# EAGLE design ethernet_jack_cnc_shield (EAGLE 9.5.0)
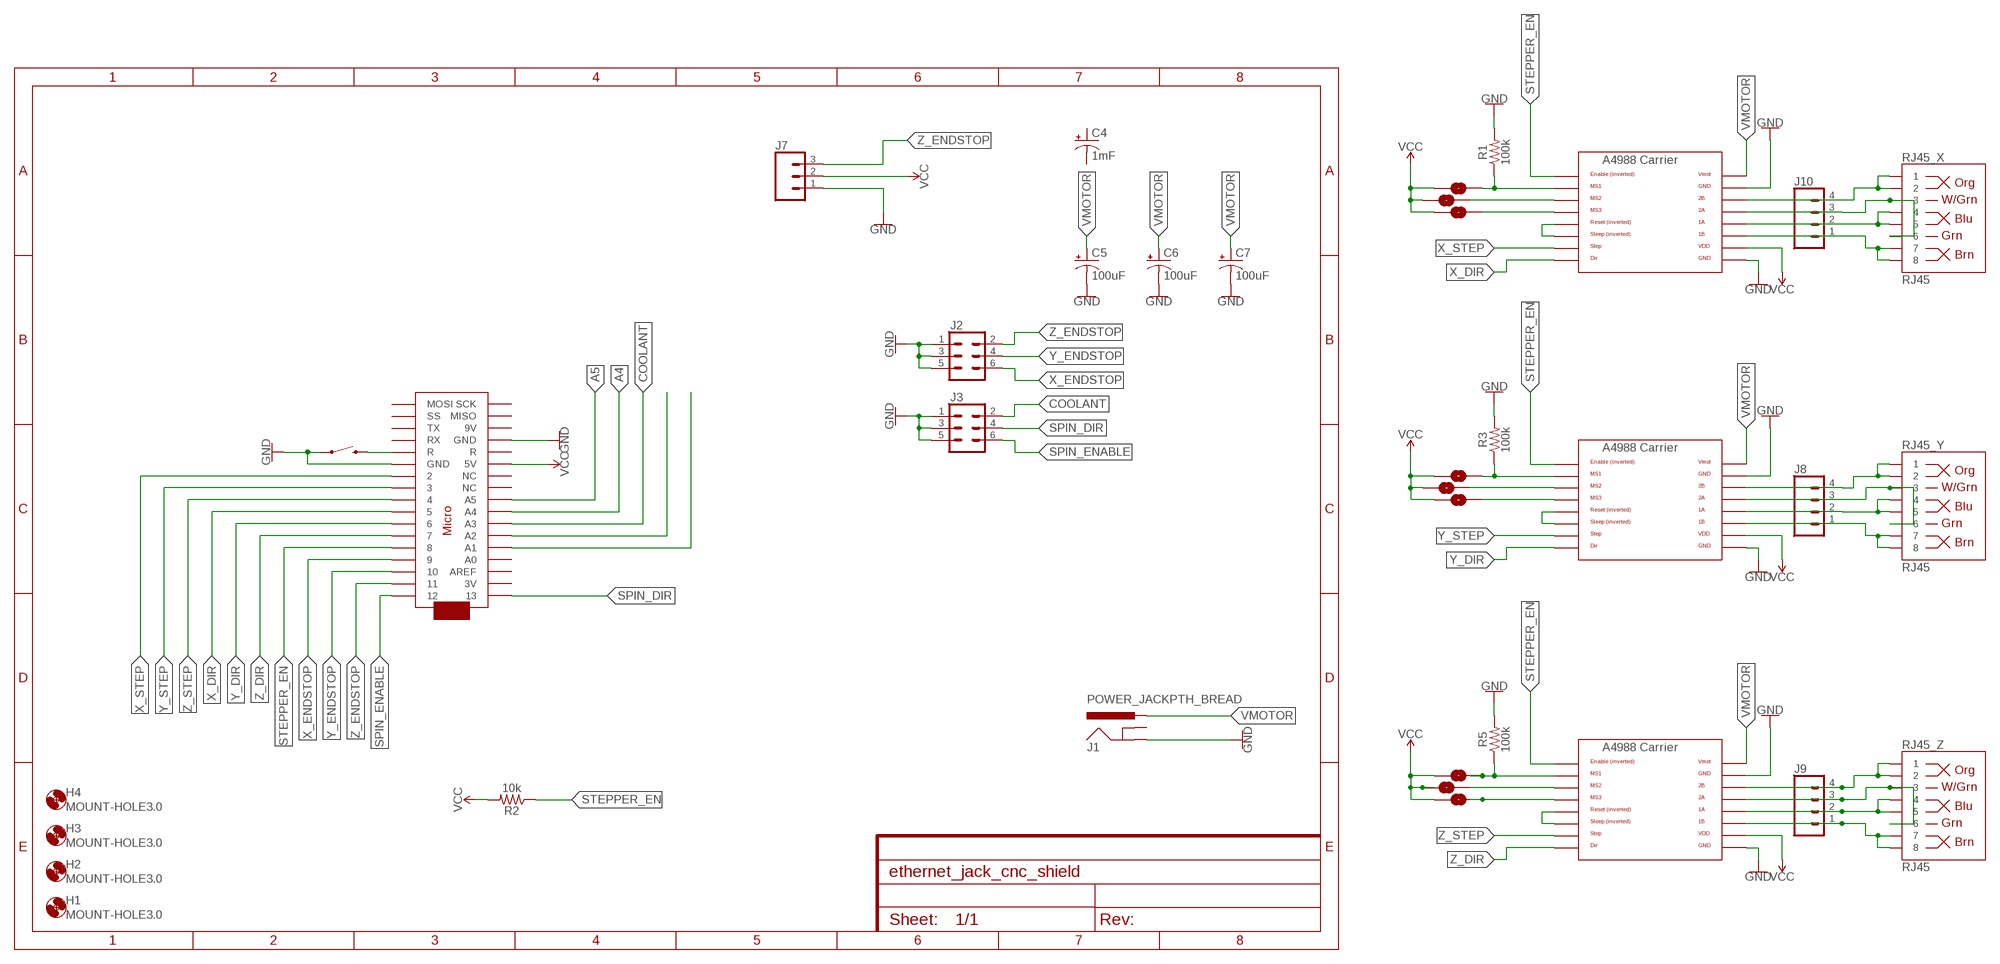
[diagram p0: schematic, sheet 1]

## Parts
C4  1mF  1000UF-RADIAL-5MM-25V-20%  [CPOL-RADIAL-5MM-10MM]
C5  100uF  100UF-POLAR-RADIAL-2.5MM-25V-20%  [CPOL-RADIAL-2.5MM-6.5MM]
C6  100uF  100UF-POLAR-RADIAL-2.5MM-25V-20%  [CPOL-RADIAL-2.5MM-6.5MM]
C7  100uF  100UF-POLAR-RADIAL-2.5MM-25V-20%  [CPOL-RADIAL-2.5MM-6.5MM]
H1  MOUNT-HOLE3.0  [3,0]
H2  MOUNT-HOLE3.0  [3,0]
H3  MOUNT-HOLE3.0  [3,0]
H4  MOUNT-HOLE3.0  [3,0]
J1  POWER_JACKPTH_BREAD  [POWER_JACK_PTH_BREAD]
J2  CONN_03X2NO_SILK  [2X3-NS]
J3  CONN_03X2NO_SILK  [2X3-NS]
J7  CONN_03  [1X03]
J8  CONN_04  [1X04]
J9  CONN_04  [1X04]
J10  CONN_04  [1X04]
JP1  JUMPER-SMT_2_NO_SILK_ROUND  [SMT-JUMPER_2_NO_SILK_ROUND]
JP2  JUMPER-SMT_2_NO_SILK_ROUND  [SMT-JUMPER_2_NO_SILK_ROUND]
JP3  JUMPER-SMT_2_NO_SILK_ROUND  [SMT-JUMPER_2_NO_SILK_ROUND]
JP4  JUMPER-SMT_2_NO_SILK_ROUND  [SMT-JUMPER_2_NO_SILK_ROUND]
JP5  JUMPER-SMT_2_NO_SILK_ROUND  [SMT-JUMPER_2_NO_SILK_ROUND]
JP6  JUMPER-SMT_2_NO_SILK_ROUND  [SMT-JUMPER_2_NO_SILK_ROUND]
JP7  JUMPER-SMT_2_NO_SILK_ROUND  [SMT-JUMPER_2_NO_SILK_ROUND]
JP8  JUMPER-SMT_2_NO_SILK_ROUND  [SMT-JUMPER_2_NO_SILK_ROUND]
JP9  JUMPER-SMT_2_NO_SILK_ROUND  [SMT-JUMPER_2_NO_SILK_ROUND]
R1  100k  RESISTOR1206  [1206]
R2  10k  RESISTOR1206  [1206]
R3  100k  RESISTOR1206  [1206]
R5  100k  RESISTOR1206  [1206]
RJ45_X  RJ45  RJ45-8  [RJ45-8]
RJ45_Y  RJ45  RJ45-8  [RJ45-8]
RJ45_Z  RJ45  RJ45-8  [RJ45-8]
S1  MOMENTARY-SWITCH-SPST-PTH-RIGHT-ANGLE-KIT  [TACTILE_SWITCH_PTH_RIGHT_ANGLE_KIT]
U$1  ARDUINOMICRO  [ARDUINOMICRO]
U$2  A4988BREAKOUT  [A4988BREAKOUT]
U$3  A4988BREAKOUT  [A4988BREAKOUT]
U$4  A4988BREAKOUT  [A4988BREAKOUT]

## Nets
A4: U$1.P$27(A4)
A5: U$1.P$26(A5)
COOLANT: J3.2 U$1.P$28(A3)
GND: C5.2(-) C6.2(-) C7.2(-) J1.GND J2.1 J2.3 J2.5 J3.1 J3.3 J3.5 J7.1 R1.2 R3.2 R5.2 S1.1 U$1.P$12(GND) U$1.P$21(GND) U$2.GND U$2.GND@0(GND) U$3.GND U$3.GND@0(GND) U$4.GND U$4.GND@0(GND)
N$1: J10.4 RJ45_X.1 RJ45_X.2 U$4.2B
N$4: J10.3 RJ45_X.3 RJ45_X.6 U$4.2A
N$6: J10.2 RJ45_X.4 RJ45_X.5 U$4.1A
N$8: J10.1 RJ45_X.7 RJ45_X.8 U$4.1B
N$10: S1.2 U$1.P$22(R)
N$12: JP6.2 U$4.MS3
N$15: U$4.RST U$4.SLP(SLEEP)
N$16: JP4.2 R1.1 U$4.MS1
N$17: JP5.2 U$4.MS2
N$18: U$1.P$29(A2)
N$19: U$1.P$30(A1)
N$20: J8.4 RJ45_Y.1 RJ45_Y.2 U$2.2B
N$21: J8.3 RJ45_Y.3 RJ45_Y.6 U$2.2A
N$22: J8.2 RJ45_Y.4 RJ45_Y.5 U$2.1A
N$23: J8.1 RJ45_Y.7 RJ45_Y.8 U$2.1B
N$24: JP7.2 U$2.MS3
N$25: JP1.2 R3.1 U$2.MS1
N$26: JP2.2 U$2.MS2
N$27: U$2.RST U$2.SLP(SLEEP)
N$28: J9.4 RJ45_Z.1 RJ45_Z.2 U$3.2B
N$29: J9.3 RJ45_Z.3 RJ45_Z.6 U$3.2A
N$30: J9.2 RJ45_Z.4 RJ45_Z.5 U$3.1A
N$31: J9.1 RJ45_Z.7 RJ45_Z.8 U$3.1B
N$32: JP9.2 U$3.MS3
N$33: JP3.2 R5.1 U$3.MS1
N$34: JP8.2 U$3.MS2
N$35: U$3.RST U$3.SLP(SLEEP)
SPIN_DIR: J3.4 U$1.P$34
SPIN_ENABLE: J3.6 U$1.P$1
STEPPER_EN: R2.1 U$1.P$5 U$2.EN U$3.EN U$4.EN
VCC: J7.2 JP1.1 JP2.1 JP3.1 JP4.1 JP5.1 JP6.1 JP7.1 JP8.1 JP9.1 R2.2 U$1.P$23(5V) U$2.VDD U$3.VDD U$4.VDD
VMOTOR: C5.1(+) C6.1(+) C7.1(+) J1.PWR U$2.VMOT U$3.VMOT U$4.VMOT
X_DIR: U$1.P$8 U$4.DIR
X_ENDSTOP: J2.6 U$1.P$4
X_STEP: U$1.P$11 U$4.STEP
Y_DIR: U$1.P$7 U$2.DIR
Y_ENDSTOP: J2.4 U$1.P$3
Y_STEP: U$1.P$10 U$2.STEP
Z_DIR: U$1.P$6 U$3.DIR
Z_ENDSTOP: J2.2 J7.3 U$1.P$2
Z_STEP: U$1.P$9 U$3.STEP
Unconnected: C4.+ C4.- J1.GNDBREAK U$1.P$13(R) U$1.P$14(RX) U$1.P$15(TX) U$1.P$16(SS) U$1.P$17(MOSI) U$1.P$18(SCK) U$1.P$19(MISO) U$1.P$20(9V) U$1.P$24(NC) U$1.P$25(NC) U$1.P$31(A0) U$1.P$32(AREF) U$1.P$33(3V)

## Library data of the parts
C4 = SparkFun-Capacitors:1000UF: 1,000µF/1mF ceramic capacitors A capacitor is a passive two-terminal electrical component used to store electrical energy temporarily in an electric field. CAP-08070; PROD_ID: CAP-09538
C5-C7 = SparkFun-Capacitors:100UF-POLAR: 100µF polarized capacitors A capacitor is a passive two-terminal electrical component used to store electrical energy temporarily in an electric field.; PROD_ID: CAP-08439
H1-H4 = holes:MOUNT-HOLE: MOUNTING HOLE with drill center marker
J1 = SparkFun-Connectors:POWER_JACK: Power Jack Connector This is the standard 5.5mm barrel jack for power. The PTH is the most common, proven, reliable, footprint. The Slot footprint only works if the mill layer is transmitted to the PCB fab house so be warned. Here are the connectors we sell at SparkFun: DC Barrel Power Jack/Connector <https://www.sparkfun.com/products/119> (PRT-00119) DC Barrel Power Jack/Connector (SMD) <https://www.sparkfun.com/products/12748> (PRT-12748) DC Barrel Jack Adapter - Breadboard Compatible <https://www.sparkfun.com/products/10811> (PRT-10811) It is used on this SparkFun product (and many, many others): SparkFun RedBoard - Programmed with Arduino <https://www.sparkfun.com/products/12757> (DEV-12757) Also, if you need a mating power supply or connector, please check these out: Wall Adapter Power Supply - 9VDC 650mA <https://www.sparkfun.com/products/298> (TOL-00298) DC Barrel Jack Adapter - Male <https://www.sparkfun.com/products/10287> (PRT-10287); PROD_ID: PRT-10811
J2 J3 = SparkFun-Connectors:CONN_03X2: Multi connection point. Often used as Generic Header-pin footprint for 0.1 inch spaced/style header connections You can populate with any combo of single row headers, but if you'd like an exact match, check these: Header - 2x3 (Male, 0.1") <https://www.sparkfun.com/products/12807> (PRT-12807) Header - 2x3 (Female, 0.1") <https://www.sparkfun.com/products/13010> (PRT-13010) 2x3 Pin Shrouded Header <https://www.sparkfun.com/products/10877> (PRT-10877) On any of the 0.1 inch spaced packages, you can populate with these: Break Away Headers - Straight <https://www.sparkfun.com/products/116> (PRT-00116) Break Away Male Headers - Right Angle <https://www.sparkfun.com/products/553> (PRT-00553) Female Headers <https://www.sparkfun.com/products/115> (PRT-00115) Break Away Headers - Machine Pin <https://www.sparkfun.com/products/117> (PRT-00117) Break Away Female Headers - Swiss Machine Pin <https://www.sparkfun.com/products/743> (PRT-00743) Special note: the shrouded connector mates well with our 3x2 ribbon cables: Ribbon Crimp Connector - 6-pin (2x3, Female) <https://www.sparkfun.com/products/10651> (PRT-10651) Ribbon Cable - 6 wire (15ft) <https://www.sparkfun.com/products/10646> (PRT-10646)
J7 = SparkFun-Connectors:CONN_03: Multi connection point. Often used as Generic Header-pin footprint for 0.1 inch spaced/style header connections On any of the 0.1 inch spaced packages, you can populate with these: Break Away Headers - Straight <https://www.sparkfun.com/products/116> (PRT-00116) Break Away Male Headers - Right Angle <https://www.sparkfun.com/products/553> (PRT-00553) Female Headers <https://www.sparkfun.com/products/115> (PRT-00115) Break Away Headers - Machine Pin <https://www.sparkfun.com/products/117> (PRT-00117) Break Away Female Headers - Swiss Machine Pin <https://www.sparkfun.com/products/743> (PRT-00743) Stackable Header - 3 Pin (Female, 0.1") <https://www.sparkfun.com/products/13875> (PRT-13875) For SCREWTERMINALS and SPRING TERMINALS visit here: Screw Terimnals on SparkFun.com <https://www.sparkfun.com/search/results?term=Screw+Terminals> (5mm/3.5mm/2.54mm spacing) This device is also useful as a general connection point to wire up your design to another part of your project. Our various solder wires solder well into these plated through hole pads. Hook-Up Wire - Assortment (Stranded, 22 AWG) <https://www.sparkfun.com/products/11375> (PRT-11375) Hook-Up Wire - Assortment (Solid Core, 22 AWG) <https://www.sparkfun.com/products/11367> (PRT-11367) View the entire wire category on our website here <https://www.sparkfun.com/categories/141> Special notes: Molex polarized connector foot print use with SKU : PRT-08232 with associated crimp pins and housings.
J8-J10 = SparkFun-Connectors:CONN_04: Multi connection point. Often used as Generic Header-pin footprint for 0.1 inch spaced/style header connections On any of the 0.1 inch spaced packages, you can populate with these: Break Away Headers - Straight <https://www.sparkfun.com/products/116> (PRT-00116) Break Away Male Headers - Right Angle <https://www.sparkfun.com/products/553> (PRT-00553) Female Headers <https://www.sparkfun.com/products/115> (PRT-00115) Break Away Headers - Machine Pin <https://www.sparkfun.com/products/117> (PRT-00117) Break Away Female Headers - Swiss Machine Pin <https://www.sparkfun.com/products/743> (PRT-00743) For SCREWTERMINALS and SPRING TERMINALS visit here: Screw Terimnals on SparkFun.com <https://www.sparkfun.com/search/results?term=Screw+Terminals> (5mm/3.5mm/2.54mm spacing) This device is also useful as a general connection point to wire up your design to another part of your project. Our various solder wires solder well into these plated through hole pads. Hook-Up Wire - Assortment (Stranded, 22 AWG) <https://www.sparkfun.com/products/11375> (PRT-11375) Hook-Up Wire - Assortment (Solid Core, 22 AWG) <https://www.sparkfun.com/products/11367> (PRT-11367) View the entire wire category on our website here <https://www.sparkfun.com/categories/141> Special notes: Molex polarized connector foot print use with SKU : PRT-08231 with associated crimp pins and housings. 1MM SMD Version SKU: PRT-10208; PROD_ID: CONN-09696
JP1-JP9 = SparkFun-Jumpers:JUMPER-SMT_2_NO: Normally open jumper This jumper has two pads in close proximity to each other. Apply solder to close the connection. Round pads are easier to solder for beginners, but are a lot larger. SparkFun Product that uses the round pads: SparkFun EL Sequencer <https://www.sparkfun.com/products/12781>
R1-R3 R5 = SparkFun-Resistors:RESISTOR: Generic Resistor Package
RJ45_X RJ45_Y RJ45_Z = SparkFun-Connectors:RJ45-8: RJ45 Jack - 8 pin Simple RJ45, 8-pin connection. Commonly used for Cat5, Cat5e, and Cat6 Ethernet cables. Here is the connector we sell at SparkFun: RJ45 8-Pin Connector <https://www.sparkfun.com/products/643> (PRT-00643) Datasheet <https://cdn.sparkfun.com/datasheets/Prototyping/04908.pdf> It is used on this SparkFun product: SparkFun RJ45 Breakout <https://www.sparkfun.com/products/716> (BOB-00716) Note, you may also be interested in the "MAGJACK" version of this. It is basically a RJ45 connector, but also has some status LEDs built into the connector housing. You can check that out in this library at the device named "MAGJACK.dev" and see these products online: RJ45 Ethernet MagJack-Compatible <https://www.sparkfun.com/products/8534> (PRT-08534) SparkFun RJ45 MagJack Breakout <https://www.sparkfun.com/products/13021> (BOB-13021); PROD_ID: CONN-08506; SF_ID: PRT-00643
S1 = SparkFun-Switches:MOMENTARY-SWITCH-SPST: Momentary Switch (Pushbutton) - SPST Normally-open (NO) SPST momentary switches (buttons, pushbuttons). Variants PTH-12MM - 12mm square, through-hole Momentary Pushbutton Switch - 12mm Square <https://www.sparkfun.com/products/9190> (COM-09190) PTH-6.0MM, PTH-6.0MM-KIT - 6.0mm square, through-hole Mini Pushbutton Switch <https://www.sparkfun.com/products/97> (COM-00097) KIT package intended for soldering kit's - only one side of pads' copper is exposed. PTH-RIGHT-ANGLE-KIT - Right-angle, through-hole Right Angle Tactile Button <https://www.sparkfun.com/products/10791> - Used on SparkFun BigTime Watch Kit <https://www.sparkfun.com/products/11734> SMD-12MM - 12mm square, surface-mount Tactile Button - SMD (12mm) <https://www.sparkfun.com/products/12993> (COM-12993) Used on SparkFun PicoBoard <https://www.sparkfun.com/products/11888> SMD-4.5MM - 4.5mm Square Trackball Switch Used on SparkFun Blackberry Trackballer Breakout <https://www.sparkfun.com/products/13169> SMD-4.6MMX2.8MM - 4.60mm x 2.80mm, surface mount Used on SparkFun SAMD21 Mini Breakout <https://www.sparkfun.com/products/13664> SMD-5.2MM, SMD-5.2-REDUNDANT - 5.2mm square, surface-mount Mini Pushbutton Switch - SMD <https://www.sparkfun.com/products/8720> (COM-08720) Used on Arduino Pro Mini <https://www.sparkfun.com/products/11114> REDUNDANT package connects both switch circuits together SMD-6.0X3.5MM - 6.0 x 3.5mm, surface mount Momentary Reset Switch SMD <https://www.sparkfun.com/products/8229> (COM-08229) SMD-6.2MM-TALL - 6.2mm square, surface mount Tactile Button - SMD (6mm) <https://www.sparkfun.com/products/12992> Used on SparkFun Digital Sandbox <https://www.sparkfun.com/products/12651> SMD-RIGHT-ANGLE - Right-angle, surface mount Used on SparkFun Block for Intel® Edison - Arduino <https://www.sparkfun.com/products/13036>; PROD_ID: CONN-10672; SF_SKU: COM-10791
U$1 = adafruit:ARDUINOMICRO
U$2-U$4 = RepRapjr:A4988BREAKOUT

## Board
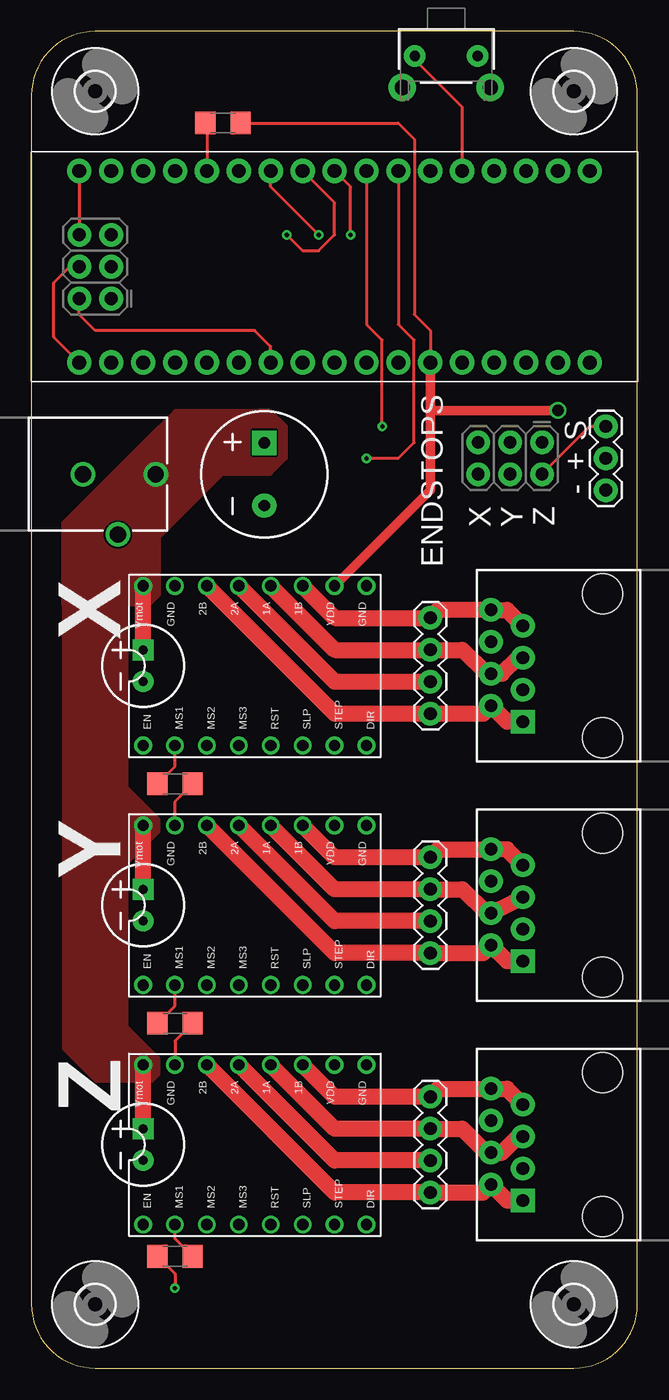
[diagram p1: board, top side]
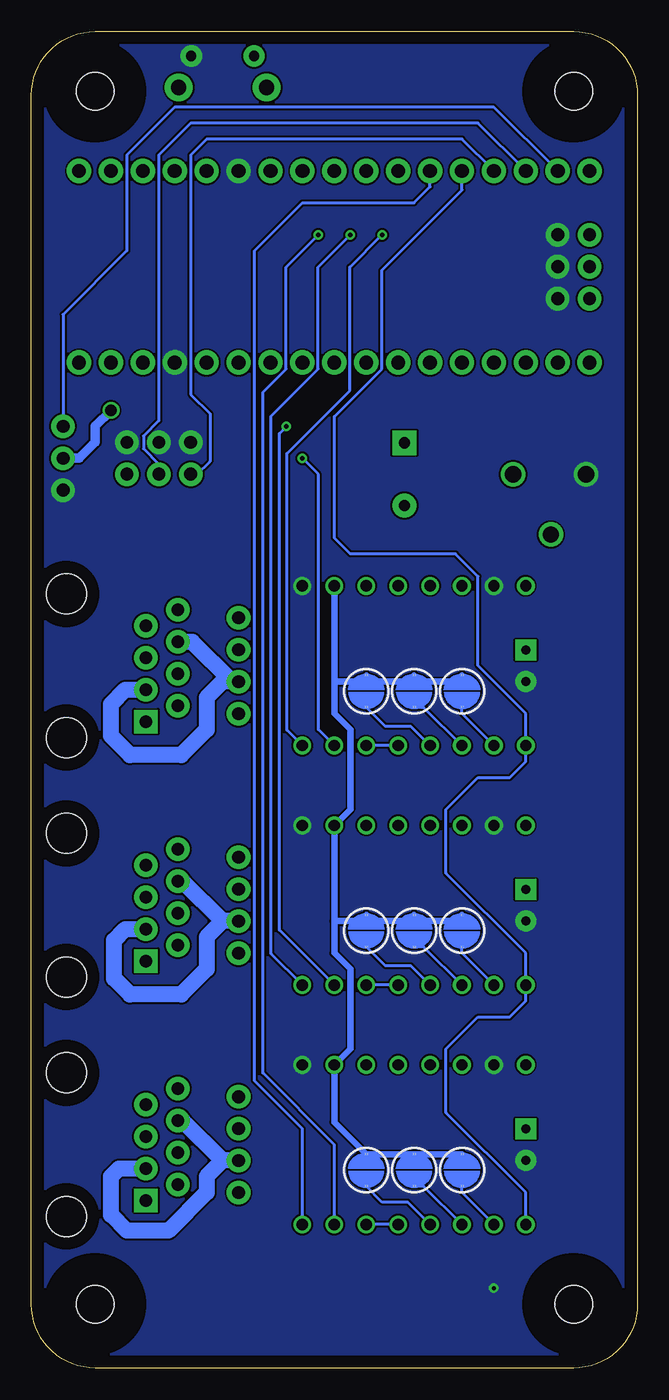
[diagram p2: board, bottom side, seen from below]

Size 48.24 x 106.35 mm. Coordinates in mm from the lower left corner, seen from the top.
Outline: 0,101.27 0,5.08 arc90 5.08,0 43.16,0 arc90 48.24,5.08 48.24,101.27 arc90 43.16,106.35 5.08,106.35 arc90 0,101.27
Copper layers (1*16): Top 0.035mm / dielectric 1.5mm / Bottom 0.035mm
Design rules "default": minimum track width 6mil, minimum drill 0.35mm, track to track 6mil, track to pad 6mil, pad to pad 6mil, via to via 6mil, smd to smd 6mil, copper to edge 40mil, drill to drill 6mil, minimum pad ring 10mil, minimum via ring 8mil, stop-mask expansion 4mil, vias tented up to drill 0mil, thermal gap 10mil

### Footprints (pad centres in the part's own frame; a part is rotated, then mirrored left to right if it is on the bottom)
CPOL-RADIAL-5MM-10MM = drill 0.9 pad 1.93 square: + 2.5,0 | drill 0.9 pad 1.93: - -2.5,0
CPOL-RADIAL-2.5MM-6.5MM = drill 0.7 pad 1.651 square: 1 1.25,0 | drill 0.7 pad 1.651: 2 -1.25,0
3,0 = hole 3: 0,0
POWER_JACK_PTH_BREAD = drill 1.3: GND 0,7.9; GNDBREAK 4.8,10.7; PWR 0,13.7
2X3-NS = drill 1.016 pad 1.88: 1 -2.54,-1.27; 2 -2.54,1.27; 3 0,-1.27; 4 0,1.27; 5 2.54,-1.27; 6 2.54,1.27
1X03 = drill 1.016 pad 1.88: 1 0,0; 2 2.54,0; 3 5.08,0
1X04 = drill 1.016 pad 1.88: 1 0,0; 2 2.54,0; 3 5.08,0; 4 7.62,0
SMT-JUMPER_2_NO_SILK_ROUND = smd 0.152 x 0.305: 1 -1.27,0; 2 1.27,0
1206 = smd 1.6 x 1.8: 1 -1.4,0; 2 1.4,0
RJ45-8 = drill 1 pad 1.88 square: 1 -4.445,6.35 | drill 1 pad 1.88: 2 -3.175,8.89; 3 -1.905,6.35; 4 -0.635,8.89; 5 0.635,6.35; 6 1.905,8.89; 7 3.175,6.35; 8 4.445,8.89 | hole 3.2: -5.715,0; 5.715,0
TACTILE_SWITCH_PTH_RIGHT_ANGLE_KIT = drill 0.8 pad 1.7: 1 -2.5,0; 2 2.5,0 | drill 1.2 pad 2.2: ANCHOR1 -3.5,2.5; ANCHOR2 3.5,2.5
ARDUINOMICRO = drill 1.1 pad 1.93: P$1 -20.32,7.62; P$2 -17.78,7.62; P$3 -15.24,7.62; P$4 -12.7,7.62; P$5 -10.16,7.62; P$6 -7.62,7.62; P$7 -5.08,7.62; P$8 -2.54,7.62; P$9 0,7.62; P$10 2.54,7.62; P$11 5.08,7.62; P$12 12.7,-7.62; P$13 10.16,-7.62; P$14 12.7,7.62; P$15 15.24,7.62; P$16 17.78,7.62; P$17 20.32,7.62; P$18 20.32,-7.62; P$19 17.78,-7.62; P$20 15.24,-7.62; P$21 7.62,7.62; P$22 10.16,7.62; P$23 7.62,-7.62; P$24 5.08,-7.62; P$25 2.54,-7.62; P$26 0,-7.62; P$27 -2.54,-7.62; P$28 -5.08,-7.62; P$29 -7.62,-7.62; P$30 -10.16,-7.62; P$31 -12.7,-7.62; P$32 -15.24,-7.62; P$33 -17.78,-7.62; P$34 -20.32,-7.62
A4988BREAKOUT = drill 0.9: 1A 8.89,1.27; 1B 11.43,1.27; 2A 6.35,1.27; 2B 3.81,1.27; DIR 16.51,-11.43; EN -1.27,-11.43; GND 16.51,1.27; GND@0 1.27,1.27; MS1 1.27,-11.43; MS2 3.81,-11.43; MS3 6.35,-11.43; RST 8.89,-11.43; SLP 11.43,-11.43; STEP 13.97,-11.43; VDD 13.97,1.27; VMOT -1.27,1.27

### Placement (x,y rotation side)
C4  18.54,71.12 90 top
C5  8.89,36.83 90 top
C6  8.89,17.78 90 top
C7  8.89,55.88 90 top
H1  43.18,5.08 0 top
H2  43.18,101.6 0 top
H3  5.08,5.08 0 top
H4  5.08,101.6 0 top
J1  -3.81,71.12 270 top
J2  38.1,72.39 180 top
J3  5.08,87.63 90 top
J7  45.72,69.85 90 top
J8  31.75,40.64 270 top
J9  31.75,21.59 270 top
J10  31.75,59.69 270 top
JP1  13.97,34.8 270 bottom
JP2  17.78,34.8 270 bottom
JP3  13.97,15.75 270 bottom
JP4  13.97,53.85 270 bottom
JP5  17.78,53.85 270 bottom
JP6  21.59,53.85 270 bottom
JP7  21.59,34.8 270 bottom
JP8  17.78,15.75 270 bottom
JP9  21.59,15.75 270 bottom
R1  11.43,46.48 0 top
R2  15.24,99.06 0 top
R3  11.43,27.43 0 top
R5  11.43,8.89 180 top
RJ45_X  45.47,55.88 90 top
RJ45_Y  45.47,36.83 90 top
RJ45_Z  45.47,17.78 90 top
S1  33.02,104.39 180 top
U$1  24.13,87.63 0 top
U$2  10.16,41.91 0 top
U$3  10.16,22.86 0 top
U$4  10.16,60.96 0 top

### Tracks (layer width: path | path; a pad name or v marks a point on that pad's centre or on a via)
COOLANT
  Top 0.254: U$1.P$28 19.05,81.28 17.78,82.55 5.08,82.55 3.81,83.82 J3.2
GND  (via drill 0.35)
  Top 0.254: R3.2 11.43,26.03 U$3.GND@0 | R5.2 11.43,7.49 v11.43,6.35 | U$2.GND@0 11.43,45.08 R1.2
  pour Bottom (no thermals): 0,0 48.26,0 48.26,106.68 0,106.68
N$1
  Top 1.27: RJ45_X.1 37.85,51.44 RJ45_X.2 35.94,52.07 J10.4 24.13,52.07 U$4.2B
N$4
  Top 1.27: U$4.2A 24.13,54.61 J10.3
  Bottom 1.27: RJ45_X.6 35.43,57.78 32.26,54.61 J10.3 33.02,54.61 34.29,53.34 34.29,50.8 36.32,48.77 40.39,48.77 41.91,50.29 41.91,52.83 40.77,53.98 RJ45_X.3
N$6
  Top 1.27: U$4.1A 24.13,57.15 J10.2 34.29,57.15 36.2,55.24 RJ45_X.4 37.46,55.24 38.74,56.52 RJ45_X.5
N$8
  Top 1.27: RJ45_X.7 37.85,60.33 RJ45_X.8 32.38,60.33 J10.1 24.13,59.69 U$4.1B
N$10
  Top 0.254: U$1.P$22 34.29,100.33 30.48,104.14 30.48,104.35 S1.2
N$12
  Bottom 0.254: U$4.MS3 18.03,51.05 20.07,51.05 JP6.2
N$15
  Bottom 0.254: U$4.RST U$4.SLP
N$16
  Top 0.254: R1.1 11.43,47.88 U$4.MS1
  Bottom 0.254: U$4.MS1 13.97,52.07 JP4.2
N$17
  Bottom 0.254: U$4.MS2 17.02,52.58 JP5.2
N$20
  Top 1.27: RJ45_Y.1 37.85,32.38 RJ45_Y.2 35.94,33.02 J8.4 24.13,33.02 U$2.2B
N$21
  Top 1.27: J8.3 24.13,35.56 U$2.2A
  Bottom 1.27: RJ45_Y.6 36.2,38.73 33.02,35.56 | J8.3 33.02,35.56 | 33.02,35.56 34.29,34.29 34.29,31.75 36.32,29.72 40.39,29.72 41.66,30.99 41.66,34.04 40.77,34.92 RJ45_Y.3
N$22
  Top 1.27: RJ45_Y.5 RJ45_Y.4 36.2,36.2 34.29,38.1 J8.2 24.13,38.1 U$2.1A
N$23
  Top 1.27: RJ45_Y.7 37.85,41.27 RJ45_Y.8 32.38,41.27 J8.1 24.13,40.64 U$2.1B
N$24
  Bottom 0.254: U$2.MS3 18.03,32 20.07,32 JP7.2
N$25
  Top 0.254: R3.1 11.43,28.83 U$2.MS1
  Bottom 0.254: U$2.MS1 13.97,33.02 JP1.2
N$26
  Bottom 0.254: U$2.MS2 17.02,33.53 JP2.2
N$27
  Bottom 0.254: U$2.RST U$2.SLP
N$28
  Top 1.27: U$3.2B 24.13,13.97 J9.4 35.94,13.97 RJ45_Z.2 37.85,13.34 RJ45_Z.1
N$29
  Top 1.27: J9.3 24.13,16.51 U$3.2A
  Bottom 1.27: RJ45_Z.6 36.2,19.68 33.02,16.51 | J9.3 33.02,16.51 | 33.02,16.51 34.29,15.24 34.29,13.97 37.34,10.92 40.64,10.92 41.91,12.19 41.91,15.24 41.27,15.88 RJ45_Z.3
N$30
  Top 1.27: U$3.1A 24.13,19.05 J9.2 34.29,19.05 36.2,17.14 RJ45_Z.4 37.46,17.14 38.74,18.41 RJ45_Z.5
N$31
  Top 1.27: U$3.1B 24.13,21.59 J9.1 32.38,22.23 RJ45_Z.8 37.85,22.23 RJ45_Z.7
N$32
  Bottom 0.254: U$3.MS3 18.29,13.21 20.32,13.21 JP9.2
N$33
  Top 0.254: R5.1 11.43,10.29 U$3.MS1
  Bottom 0.254: U$3.MS1 13.97,13.97 JP3.2
N$34
  Bottom 0.254: U$3.MS2 17.02,14.48 JP8.2
N$35
  Bottom 0.254: U$3.RST U$3.SLP
SPIN_DIR
  Top 0.254: U$1.P$34 1.78,82.04 1.78,86.36 3.05,87.63 J3.4
SPIN_ENABLE
  Top 0.254: U$1.P$1 J3.6
STEPPER_EN
  Top 0.254: R2.1 13.97,98.93 U$1.P$5
  Bottom 0.254: U$3.EN 8.89,13.97 15.24,20.32 15.24,25.4 12.7,27.94 10.16,27.94 8.89,29.21 U$2.EN 8.89,33.02 15.24,39.37 15.24,44.45 12.7,46.99 10.16,46.99 8.89,48.26 U$4.EN 8.89,52.07 12.7,55.88 12.7,62.99 14.48,64.77 22.86,64.77 24.13,66.04 24.13,75.71 20.34,79.49 20.34,87.35 13.97,93.73 U$1.P$5
VCC  (via drill 0.9)
  Top 0.254: R2.2 29.21,99.06 30.48,97.79 30.48,83.82 31.75,82.55 U$1.P$23
  Top 0.762: U$4.VDD 31.75,69.85 31.75,76.2 | U$1.P$23 31.75,76.2 | 31.75,76.2 v41.91,76.2
  Bottom 0.508: 24.13,35.56 U$2.VDD 22.86,44.45 22.86,50.8 24.13,52.07 24.13,54.61 | 24.13,35.56 24.13,33.02 22.86,31.75 22.86,25.4 U$3.VDD 24.13,19.56 JP9.1 JP8.1 JP3.1 | 24.13,54.61 U$4.VDD | 24.13,54.61 21.59,54.61 | 21.59,54.61 JP6.1 | 21.59,54.61 17.78,54.61 | 17.78,54.61 JP5.1 | 17.78,54.61 14.48,54.61 JP4.1 | 24.13,35.56 21.59,35.56 | 21.59,35.56 JP7.1 | 21.59,35.56 17.78,35.56 | 17.78,35.56 JP2.1 | 17.78,35.56 14.48,35.56 JP1.1
  Bottom 0.762: v41.91,76.2 43.18,74.93 43.18,73.66 44.45,72.39 J7.2
VMOTOR
  Top 1.27: C7.1 U$4.VMOT | C5.1 U$2.VMOT | C6.1 U$3.VMOT
  pour Top (no thermals): 2.54,60.71 2.54,67.31 8.89,73.66 11.43,73.66 12.7,72.39 12.7,68.58 10.16,66.04 10.16,61.47 9.4,60.71
  pour Top (no thermals): 2.54,60.96 2.54,25.4 5.08,22.86 9.65,22.86 10.16,23.37 10.16,24.64 7.62,27.18 7.62,40.13 10.16,42.67 10.16,43.69 7.62,46.23 7.62,60.96
  pour Top (no thermals): 19.05,76.2 11.43,76.2 8.89,73.66 8.89,68.58 12.7,68.58 15.24,71.12 19.05,71.12 20.32,72.39 20.32,74.93
X_DIR  (via drill 0.35)
  Top 0.254: v20.32,90.17 21.59,88.9 22.86,88.9 24.13,90.17 24.13,92.71 U$1.P$8
  Bottom 0.254: v20.32,90.17 22.88,87.61 22.88,77.78 27.91,72.76 27.91,50.77 U$4.DIR
X_ENDSTOP
  Bottom 0.254: U$1.P$4 13.97,97.79 34.29,97.79 35.56,96.52 35.56,77.47 34.04,75.95 34.04,72.14 35.05,71.12 J2.6
X_STEP  (via drill 0.35)
  Top 0.254: U$1.P$11 29.21,83.04 30.46,81.8 30.46,73.64 29.21,72.39 v26.67,72.39
  Bottom 0.254: U$4.STEP 25.4,50.8 25.4,71.12 v26.67,72.39
Y_DIR  (via drill 0.35)
  Top 0.254: v22.86,90.17 19.05,93.98 U$1.P$7
  Bottom 0.254: U$2.DIR 29.16,32.97 29.16,75.76 25.43,79.49 25.43,87.61 v22.86,90.17
Y_ENDSTOP
  Bottom 0.254: U$1.P$3 12.7,99.06 35.56,99.06 38.1,96.52 38.1,75.38 39.32,74.17 39.32,73.16 38.1,71.94 J2.4
Y_STEP  (via drill 0.35)
  Top 0.254: U$1.P$10 26.67,83.04 27.91,81.8 27.91,74.95 v27.94,74.93
  Bottom 0.254: U$2.STEP 28.5,34.85 28.5,74.37 v27.94,74.93
Z_DIR
  Bottom 0.254: U$3.DIR 26.67,19.05 30.48,22.86 30.48,88.9 26.67,92.71 17.78,92.71 16.51,93.98 U$1.P$6
Z_ENDSTOP
  Top 0.254: J2.2 44.45,74.93 J7.3
  Bottom 0.254: U$1.P$2 11.43,100.33 36.83,100.33 40.64,96.52 40.64,88.9 45.72,83.82 J7.3
Z_STEP  (via drill 0.35)
  Top 0.254: v25.4,90.17 25.4,93.98 U$1.P$9
  Bottom 0.254: U$3.STEP 24.13,17.78 29.82,23.47 29.82,77.64 27.97,79.49 27.97,87.61 v25.4,90.17

### Text on the board
tPlace: ENDSTOPS | S | + | - | X | Y | Z | X | Y | Z